# Altium schematic sheet HalfBridge.SchDoc
size A4
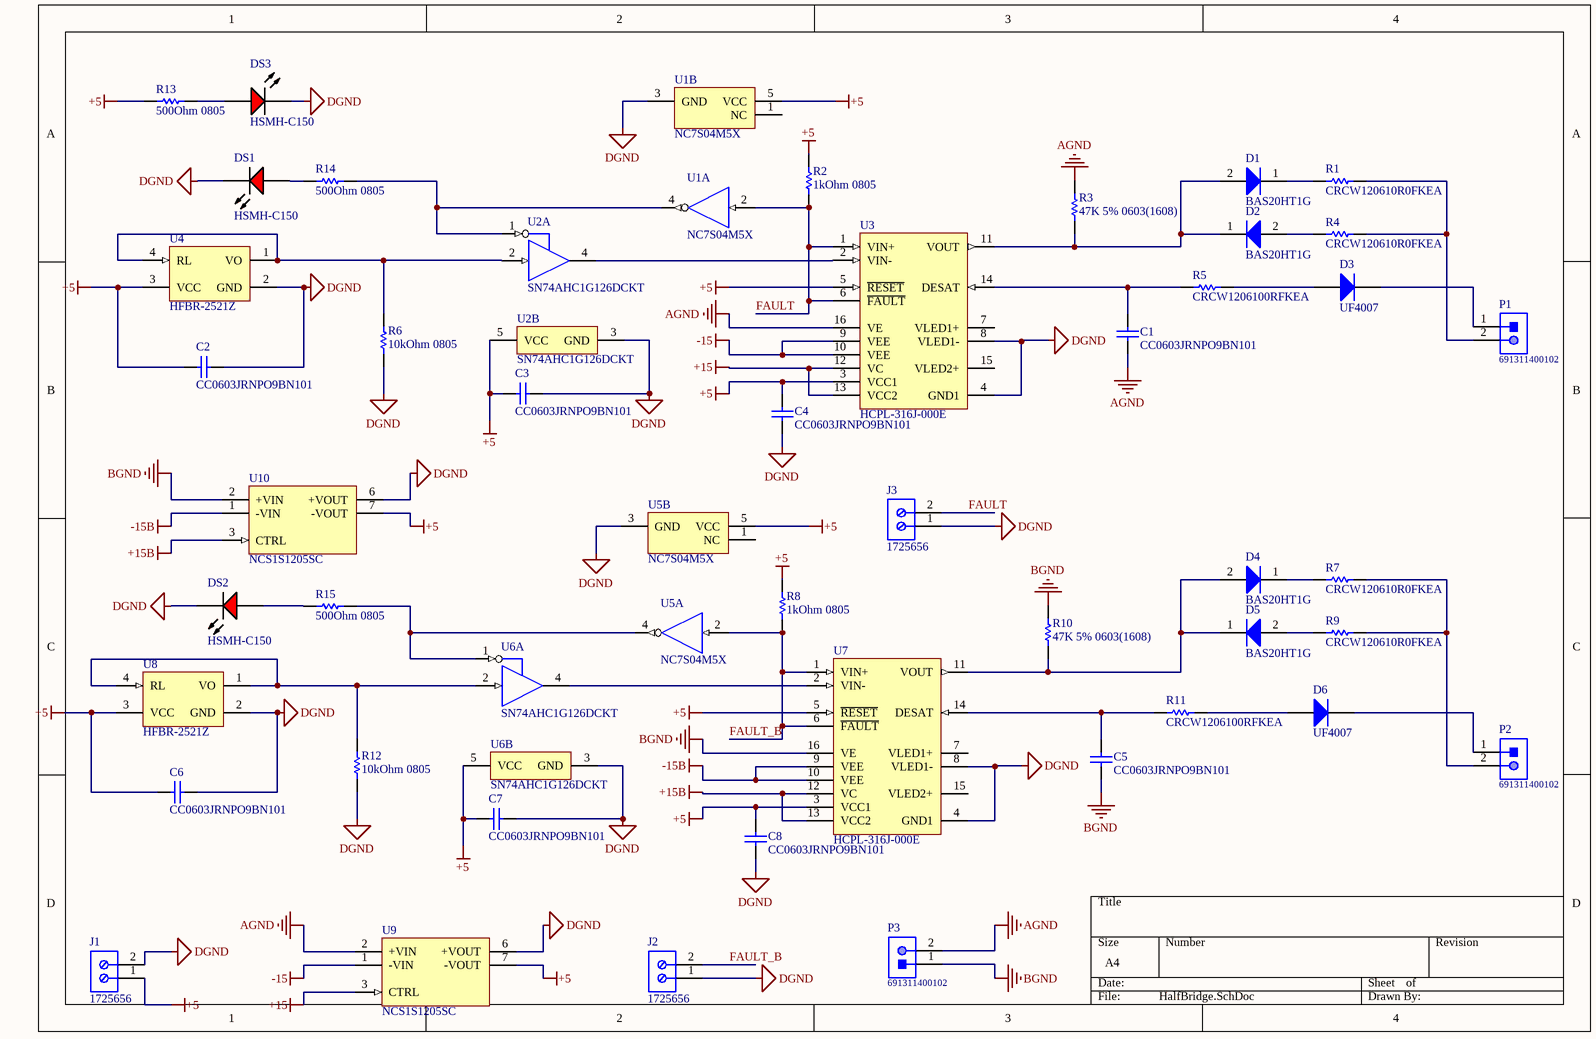
[diagram p0: HalfBridge.SchDoc]

## Parts
C1  CC0603JRNPO9BN101  [CAPC1608X90X40ML10T20]
C2  CC0603JRNPO9BN101  [CAPC1608X90X40ML10T20]
C3  CC0603JRNPO9BN101  [CAPC1608X90X40ML10T20]
C4  CC0603JRNPO9BN101  [CAPC1608X90X40ML10T20]
C5  CC0603JRNPO9BN101  [CAPC1608X90X40ML10T20]
C6  CC0603JRNPO9BN101  [CAPC1608X90X40ML10T20]
C7  CC0603JRNPO9BN101  [CAPC1608X90X40ML10T20]
C8  CC0603JRNPO9BN101  [CAPC1608X90X40ML10T20]
D1  BAS20HT1G  [ONSC-SOD-323-2-477-02_V]
D2  BAS20HT1G  [ONSC-SOD-323-2-477-02_V]
D3  UF4007  [FAIR-DO-41-2]
D4  BAS20HT1G  [ONSC-SOD-323-2-477-02_V]
D5  BAS20HT1G  [ONSC-SOD-323-2-477-02_V]
D6  UF4007  [FAIR-DO-41-2]
DS1  HSMH-C150  [AVAG-HSMX-C150_V]
DS2  HSMH-C150  [AVAG-HSMX-C150_V]
DS3  HSMH-C150  [AVAG-HSMX-C150_V]
J1  1725656  [PHOE-1725656-2]
J2  1725656  [PHOE-1725656-2]
J3  1725656  [PHOE-1725656-2]
P1  691311400102  [691311400102]
P2  691311400102  [691311400102]
P3  691311400102  [691311400102]
R1  CRCW120610R0FKEA  [RESC3216X60X45ML10T20]
R2  1kOhm 0805  [RESC2013X50X30LL20T20]
R3  47K 5% 0603(1608)  [RESC0603(1608)_L]
R4  CRCW120610R0FKEA  [RESC3216X60X45ML10T20]
R5  CRCW1206100RFKEA  [RESC3216X60X45ML10T20]
R6  10kOhm 0805  [RESC2013X50X30LL20T20]
R7  CRCW120610R0FKEA  [RESC3216X60X45ML10T20]
R8  1kOhm 0805  [RESC2013X50X30LL20T20]
R9  CRCW120610R0FKEA  [RESC3216X60X45ML10T20]
R10  47K 5% 0603(1608)  [RESC0603(1608)_L]
R11  CRCW1206100RFKEA  [RESC3216X60X45ML10T20]
R12  10kOhm 0805  [RESC2013X50X30LL20T20]
R13  500Ohm 0805  [RESC2013X50X30LL20T20]
R14  500Ohm 0805  [RESC2013X50X30LL20T20]
R15  500Ohm 0805  [RESC2013X50X30LL20T20]
U1  NC7S04M5X  [FAIR-SOT23-5_V]  (parts A,B of 2)
U2  SN74AHC1G126DCKT  [DCK0005A_N]  (parts A,B of 2)
U3  HCPL-316J-000E  [AVAG-SOIC-16_V]
U4  HFBR-2521Z  [BCM-HFBR-2521Z-4]
U5  NC7S04M5X  [FAIR-SOT23-5_V]  (parts A,B of 2)
U6  SN74AHC1G126DCKT  [DCK0005A_N]  (parts A,B of 2)
U7  HCPL-316J-000E  [AVAG-SOIC-16_V]
U8  HFBR-2521Z  [BCM-HFBR-2521Z-4]
U9  NCS1S1205SC  [MURA-NCS1S1205SC-5_V]
U10  NCS1S1205SC  [MURA-NCS1S1205SC-5_V]

## Nets
+5: C2.1 C3.1 C4.1 C6.1 C7.1 C8.1 J1.1 R2.2 R8.2 R13.2 U1.5(VCC) U2.5(VCC) U3.3(VCC1) U3.5(~{RESET}) U4.3(VCC) U5.5(VCC) U6.5(VCC) U7.3(VCC1) U7.5(~{RESET}) U8.3(VCC) U9.7(-VOUT) U10.7(-VOUT)
+15: U3.12(VC) U3.13(VCC2) U9.3(CTRL)
+15B: U7.12(VC) U7.13(VCC2) U10.3(CTRL)
-15: U3.9(VEE) U3.10(VEE) U9.1(-VIN)
-15B: U7.9(VEE) U7.10(VEE) U10.1(-VIN)
AGND: C1.2 P3.2 R3.2 U3.16(VE) U9.2(+VIN)
BGND: C5.2 P3.1 R10.2 U7.16(VE) U10.2(+VIN)
DGND: C2.2 C3.2 C4.2 C6.2 C7.2 C8.2 DS1.2(K) DS2.2(K) DS3.2(K) J1.2 J2.1 J3.1 R6.1 R12.1 U1.3(GND) U2.3(GND) U3.4(GND1) U3.8(VLED1-) U4.2(GND) U5.3(GND) U6.3(GND) U7.4(GND1) U7.8(VLED1-) U8.2(GND) U9.6(+VOUT) U10.6(+VOUT)
FAULT: J3.2 R2.1 U1.2(A) U3.1(VIN+) U3.6(~{FAULT})
FAULT_B: J2.2 R8.1 U5.2(A) U7.1(VIN+) U7.6(~{FAULT})
NetC1_1: C1.1 R5.1 U3.14(DESAT)
NetC5_1: C5.1 R11.1 U7.14(DESAT)
NetD1_1: D1.1(K) R1.1
NetD1_2: D1.2(A) D2.1(K) R3.1 U3.11(VOUT)
NetD2_2: D2.2(A) R4.1
NetD3_1: D3.1(A) R5.2
NetD3_2: D3.2(K) P1.1
NetD4_1: D4.1(K) R7.1
NetD4_2: D4.2(A) D5.1(K) R10.1 U7.11(VOUT)
NetD5_2: D5.2(A) R9.1
NetD6_1: D6.1(A) R11.2
NetD6_2: D6.2(K) P2.1
NetDS1_1: DS1.1(A) R14.2
NetDS2_1: DS2.1(A) R15.2
NetDS3_1: DS3.1(A) R13.1
NetP1_2: P1.2 R1.2 R4.2
NetP2_2: P2.2 R7.2 R9.2
NetR6_2: R6.2 U2.2(A) U4.1(VO) U4.4(RL)
NetR12_2: R12.2 U6.2(A) U8.1(VO) U8.4(RL)
NetR14_1: R14.1 U1.4(Y) U2.1(OE)
NetR15_1: R15.1 U5.4(Y) U6.1(OE)
NetU2_4: U2.4(Y) U3.2(VIN-)
NetU6_4: U6.4(Y) U7.2(VIN-)

Not connected (* = marked no-connect by the designer): U1 1(NC); U3 7(VLED1+) 15(VLED2+); U5 1(NC); U7 7(VLED1+) 15(VLED2+)

## Library data of the parts
C1-C8 = CMP-2100-03594-1: Chip Capacitor, 100 pF, +/- 5%, 50 V, -55 to 125 degC, 0603 (1608 Metric), RoHS, Tape and Reel; Manufacturer: Yageo; Capacitance: 100pF; Voltage Rating (DC): 50V; Dielectric: C0G; Temperature Coefficient: 30ppm/degC; Insulation Resistance: 100GR; Datasheet Version: Rev. 14, 07/2016; Manufacturer URL: http://www.yageo.com/; Packaging: TapeandReel; Mount: SurfaceMount; RoHSCompliant: True; Package Reference: 0603; Tolerance: 5%; Max Operating Temperature: 125degC; Case Code (Imperial): 0603; Number of Pins: 2; Width: 0.8mm; Case Code (Metric): 1608; Voltage: 50V; REACH SVHC: Unknown; Package Description: 2-Pin Surface Mount Device, Body 1.6 x 0.8 mm; Composition: Ceramic; Lead Free: LeadFree; Min Operating Temperature: -55degC; Radiation Hardening: No; Depth: 0.8mm; Thickness: 0.035inch; Datasheet URL: http://www.yageo.com/documents/recent/UPY-GP_NP0_16V-to-50V_14.pdf; Termination: SMD/SMT; Package Quantity: 1; Length: 1.6mm; Voltage Rating: 50V; Height: 0.8mm; Case/Package: 0603
D1 D2 D4 D5 = CMP-1054-00067-1: High Voltage Switching Diode, 2-Pin SOD-323, Pb-Free, Tape and Reel; Manufacturer: On Semiconductor; trr Max (ns): 50; IF Max (A): 0.2; Configuration: Single; Packing: Tape and Reel; RoHS: TRUE; DatasheetVersion: Rev. 6; Mounting Technology: Surface Mount; PartNumber: BAS20HT1G; ComponentLink2URL: http://www.onsemi.com/pub_link/Collateral/BAS20HT1-D.PDF; PackageReference: SOD-323-2-477-02; ComponentLink3URL: http://www.onsemi.com/pub_link/Collateral/477-02.PDF.1; PackageVersion: Rev. H, 03/2007; PackageDescription: 2-Pin SOD, Body 1.7 x 1.25 mm; ComponentLink1Description: Manufacturer URL; ComponentLink3Description: Package Specification; ComponentLink1URL: http://www.onsemi.com/; ComponentLink2Description: Datasheet
D3 D6 = CMP-2000-05028-1: Fast Rectufuer, 2.08 W, 2-Pin DO-41, RoHS, Tape and Reel; Manufacturer: Fairchild; Voltage - Forward (Vf) (Max) @ If: 1.7V@1A; Speed: FastRecovery= / 200mA(Io); Online Catalog: StandardDiode; Other Names: UF4007CT; Diode Type: Standard; Current - Average Rectified (Io): 1A; Voltage - DC Reverse (Vr) (Max): 1000V(1kV); Capacitance @ Vr, F: 17pF@4V,1MHz; Package Version: Rev. 2, 09/2008; Current - Reverse Leakage @ Vr: 10µA@1000V; Reverse Recovery Time (trr): 75ns; Standard Package: 1; Packaging: CutTape(CT); Datasheet Version: Rev. 1.1.0, 11/2014; Family: Diodes,Rectifiers-Single; Datasheet URL: https://www.fairchildsemi.com/datasheets/UF/UF4001.pdf; Operating Temperature - Junction: -65degC~150degC; Supplier Device Package: DO-41; Package URL: http://www.fairchildsemi.com/dwg/DO/DO41A.pdf; Package / Case: DO-204AL,DO-41,Axial; Mounting Type: ThroughHole; Category: DiscreteSemiconductorProducts; Package Reference: DO-41-2; Package Description: 2-Pin Axial Lead, Dia 2.375 mm, Body Length 4.63 mm; Manufacturer URL: https://www.fairchildsemi.com/
DS1-DS3 = CMP-2000-06426-1: LED Uni-Color Red, 65 mW, 25 mA, -40 to 85 degC, 2-Pin SMD, RoHS, Tape and Reel; Manufacturer: Avago; Product Height (mm): 1.1mm; Power Dissipation: 78W; Product Length (mm): 3.2mm; Forward Voltage: 2.6V; Luminous Intensity: 17mcd; DELETED: Compliant; Shape Type: Rectangular; Peak Wavelength: 660nm; Main Category: ChipLED; Dominant Wave Length: 639nm; Rad Hardened: No; Lens Type: ColorlessDiffused; Product Depth (mm): 1.6mm; Reverse Voltage: 5V; Forward Current: 25mA; Chip Material: GaAlAs; Test Current (It): 20mA; Viewing Angle: 170deg; Number of  Elements: 1; Type: Uni-Color; Package Reference: HSMX-C150; Package Description: 2-Pin Surface Mount Device, Body 3.2 x 1.6 mm; Operating Temp Range: -40Cto85C; Mounting: SurfaceMount; Emitting Color: Red; Pin Count: 2; Operating Temperature Classification: Industrial; Datasheet URL: http://media.digikey.com/pdf/Data%20Sheets/Avago%20PDFs/HSMz-Czzz.pdf; Package Type: ChipLed; Mounting Technology: SurfaceMount; High Brightness: No; Lens Dimensions: 2x1.6x0.6mm; Manufacturer URL: http://www.avagotech.com/; Lum Intensity: 17mcd; Datasheet Version: 03/2012; Packaging: TapeandReel
J1-J3 = CMP-2000-05299-1: Male Header, Pitch 2.54 mm, 1 x 2 Position, Height 9 mm, Tail Length 3.5 mm; Manufacturer: Phoenix Contact; Number of contacts: 2; Content: 250pc(s); Pitch: 2.54mm; Industrial packaging: Yes; Colour: Green; Manufacturer part No.: 1725656; Type: MPT0,5/2-2,54; Datasheet URL: http://datasheet.octopart.com/1725656-Phoenix-Contact-datasheet-5302866.pdf; Manufacturer URL: http://www.phoenixcontact.com/; Datasheet Version: Apr-08
P1-P3 = CMP-1502-02408-1: Serie 3114 - 7.62mm Close Vertical PCB Header WR-TBL, 2 pin; Manufacturer: Wurth Elektronik; Gender: Male; Pin Number: 2; Package Reference: 691311400102; Publisher: WurthElektronik; Mounting Technology: THT; Pitch: 7.62mm; Datasheet URL: http://katalog.we-online.de/em/datasheet/6913114001xx.pdf; Part Number: 691311400102; Packaging: Box; Manufacturer URL: http://www.we-online.de; Operating Temperature: -40to105degC
R1 R4 R7 R9 = CMP-2003-04815-1: Manufacturer: Vishay Dale; Part Number: CRCW120610R0FKEA
R2 R6 R8 R12-R15 = CMP-2001-04896-1: Manufacturer: Vishay Dale; Part Number: CRCW08050000Z0EA
R3 R10 = CMP-1012-00114-1: 47K 0.1W 5% 0603 (1608 Metric)  SMD; Case-EIA: 0603; Value: 47000.00 Ohm; Case-Metric: 1608; Tolerance: 5 %; Power: 0.1 W; Technology: SMT
R5 R11 = CMP-2003-04801-1: Manufacturer: Vishay Dale; Part Number: CRCW1206100RFKEA
U1 U5 = CMP-2000-06807-1: TinyLogic(R) HS Inverter, 2.6 mA, 2 to 6 V, -40 to 85 degC, 5-Pin SOT23, RoHS, Tape and Reel; Manufacturer: Fairchild Semiconductor; Current - Quiescent (Max): 1µA; Package Version: 08/2015; Logic Level - High: 1.5V; Current - Output High, Low: 2.6mA,2.6mA; Other Names: NC7S04M5XDKR; Logic Level - Low: 0.5V; Number of Circuits: 1; Logic Type: Inverter,Buffer; Dynamic Catalog: 7S; Voltage - Supply: 2V~6V; Max Propagation Delay @ V, Max CL: 17ns@6V,50pF; Product Change Notification: MoldCompoundChange12/Dec/2007; Supplier Device Package: SOT-23-5; Package Description: 5-Pin Small Outline Transistor, Body 2.9 x 1.6 mm, Pitch 0.95 mm; Series: 7S; Packaging: Digi-Reel®; Package URL: https://www.fairchildsemi.com/package-drawings/MA/MA05B.pdf; Package Reference: SOT23-5; Datasheet URL: https://www.fairchildsemi.com/datasheets/NC/NC7S04.pdf; Category: IntegratedCircuits(ICs); Features: -; Manufacturer URL: https://www.fairchildsemi.com/; Family: Logic-GatesandInverters; Package / Case: SC-74A,SOT-753; Mounting Type: SurfaceMount; Mounting Technology: SurfaceMount; Standard Package: 1; Operating Temperature: -40°C~85°C; Datasheet Version: 08/2004; Number of Inputs: 1
U2 U6 = CMP-0859-00345-3: Single Bus Buffer Gate With 3-State Outputs, DCK0005A, SMALL T&R; Manufacturer: Texas Instruments; ICC @ Nom Voltage(Max)(mA): 0.01; Technology Family: AHC; VCC(Max)(V): 5.5; Output Type: CMOS; Voltage(Nom)(V): 3.3,5; 3-State Output: Yes; Bits(#): 1; Logic: True; VCC(Min)(V): 2; Sub-Family: Non-Inverting Buffer/Driver; F @ Nom Voltage(Max)(Mhz): 75; tpd @ Nom Voltage(Max)(ns): 11.5,7.5; Rating: Catalog; Output Drive (IOL/IOH)(Max)(mA): 50/-50; Schmitt Trigger: No; PackageReference: DCK0005A; Generic Part Number: SN74AHC1G126; Operating Temperature Range(C): -40 to 125,-40 to 85; DatasheetVersion: SCLS379K; Input Type: CMOS
U3 U7 = CMP-2000-06392-1: Gate Drive Optocoupler with Integrated (VCE) Desaturation Detection and Fault Status Feedback, 2.5 A, 15 to 30 V, -40 to 100 degC, 16-Pin SOIC, RoHS, Tube; Manufacturer: AvagoTechnologies; Common Mode Voltage: 1500V; Maximum Operating Supply Voltage: 30V; Maximum Working Insulation Voltage: 1230Vp; Minimum Common Mode Rejection: 15kV/us; Maximum Pulse Width Distortion: 300ns; Minimum Isolation Voltage: 3750Vrms; Agency Approvals: CSA/DIN/EN/IEC/UL/VDE; Pin_Count: 16; Maximum Fall Time: 100(Typ)ns; Number of Channels per Chip: 2; Maximum Propagation Delay Time(tPLH): 500ns; Maximum Peak Output Current: 2.5A; Maximum Power Dissipation: 1200mW; Manufacturer URL: http://www.avagotech.com/; Operating Temperature: -40to100C; Package Description: 16-Pin Small Outline Integrated Circuit, Body 10.312 x 7.493 mm, Pitch 1.27 mm; Package Reference: SOIC-16; Output Type: N/A; Datasheet Version: 03/2015; Packaging: N/A; Maximum Forward Current: N/A; Minimum Peak Output Current: N/A; Screening Level: N/A; Maximum Reverse Voltage: N/A; Mounting Technology: SurfaceMount; Part No: HCPL-316J-000E; Dimension: 10.31x7.49x3.51mm; Family: HCPL-316J; Maximum Forward Voltage: N/A; Minimum Forward Current: N/A; Maximum Propagation Delay Time(tPHL): 500ns; Mounting: SurfaceMount; RoHS: Yes; Minimum Forward Voltage: N/A; Maximum Rise Time: 100(Typ)ns; Supplier_Package: SOIC; Datasheet URL: http://www.avagotech.com/docs/AV02-0717EN
U4 U8 = CMP-2000-05068-1: The Versatile Fiber Optic Connection, 5 MBd, -40 to 85 degC, 4-Pin, RoHS, Rail/Tube; Manufacturer: Broadcom; Peak Wavelength: 600nm; Maximum Data Rate: 5MBd; Maximum Power Dissipation: 40mW; Maximum Output Current: 25mA; Maximum Operating Supply Voltage: 7V; Typical Operating Supply Voltage: 1.8V; Product Height: 7.6mm; Product Width: 12.2mm; Minimum Operating Supply Voltage: -0.5V; Pin_Count: 6; Product Length: 18.8mm; Connector Type: Round; Maximum Operating Temperature: 85C; Type: RX; Family: HFBR-2521; Manufacturer URL: http://www.broadcom.com/; Product Type: OpticalFiber; Minimum Operating Temperature: -40C; Package URL: http://docs.avagotech.com/docs/AV02-1501EN; Datasheet Version: Sep-14; Mounting: ThroughHole; Datasheet URL: http://docs.avagotech.com/docs/AV02-1501EN
U9 U10 = CMP-1287-00003-1: Isolated 1 W 4:1 Input Single Output DC/DC Converter, 5 V, -40 to 105 degC, 5-Pin THD, Pb-Free, Tube; Generic Part Number: NCS1; Supply Voltage Min: 4.5 V; Number of Outputs: 1; Supply Voltage Max: 18 V; VOUT: 5 V; Output Current: 0.2 A; ComponentLink1URL: http://www.murata.com/; ComponentLink2Description: Datasheet; Packing: Tube; Mounting Technology: Through Hole; PartNumber: NCS1S1205SC; ComponentLink1Description: Manufacturer URL; PackageDescription: 5-Pin Through Hole Device, Body 21.87x8.2mm, Pitch 2.54mm; Temperature Max: 105 degC; Temperature Min: -40 degC; ComponentLink2URL: http://power.murata.com/data/power/ncl/kdc_ncs1.pdf; RoHS: TRUE